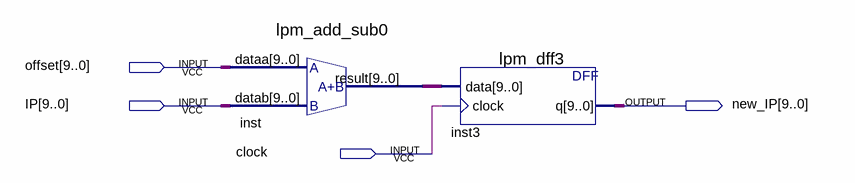
[diagram p0: schematic sheet]
// Quartus schematic NewIP_Register.bdf as structural Verilog: 2 symbols, 4 pins
module NewIP_Register (
  input  [9:0] offset,
  input  [9:0] IP,
  input  clock,
  output [9:0] new_IP
);

  wire [9:0] inst_result;

  lpm_add_sub0 inst (.dataa(offset), .datab(IP), .result(inst_result));
  lpm_dff3 inst3 (.data(inst_result), .clock(clock), .q(new_IP));
endmodule
